# Altium project WireFeeder.PrjPcb
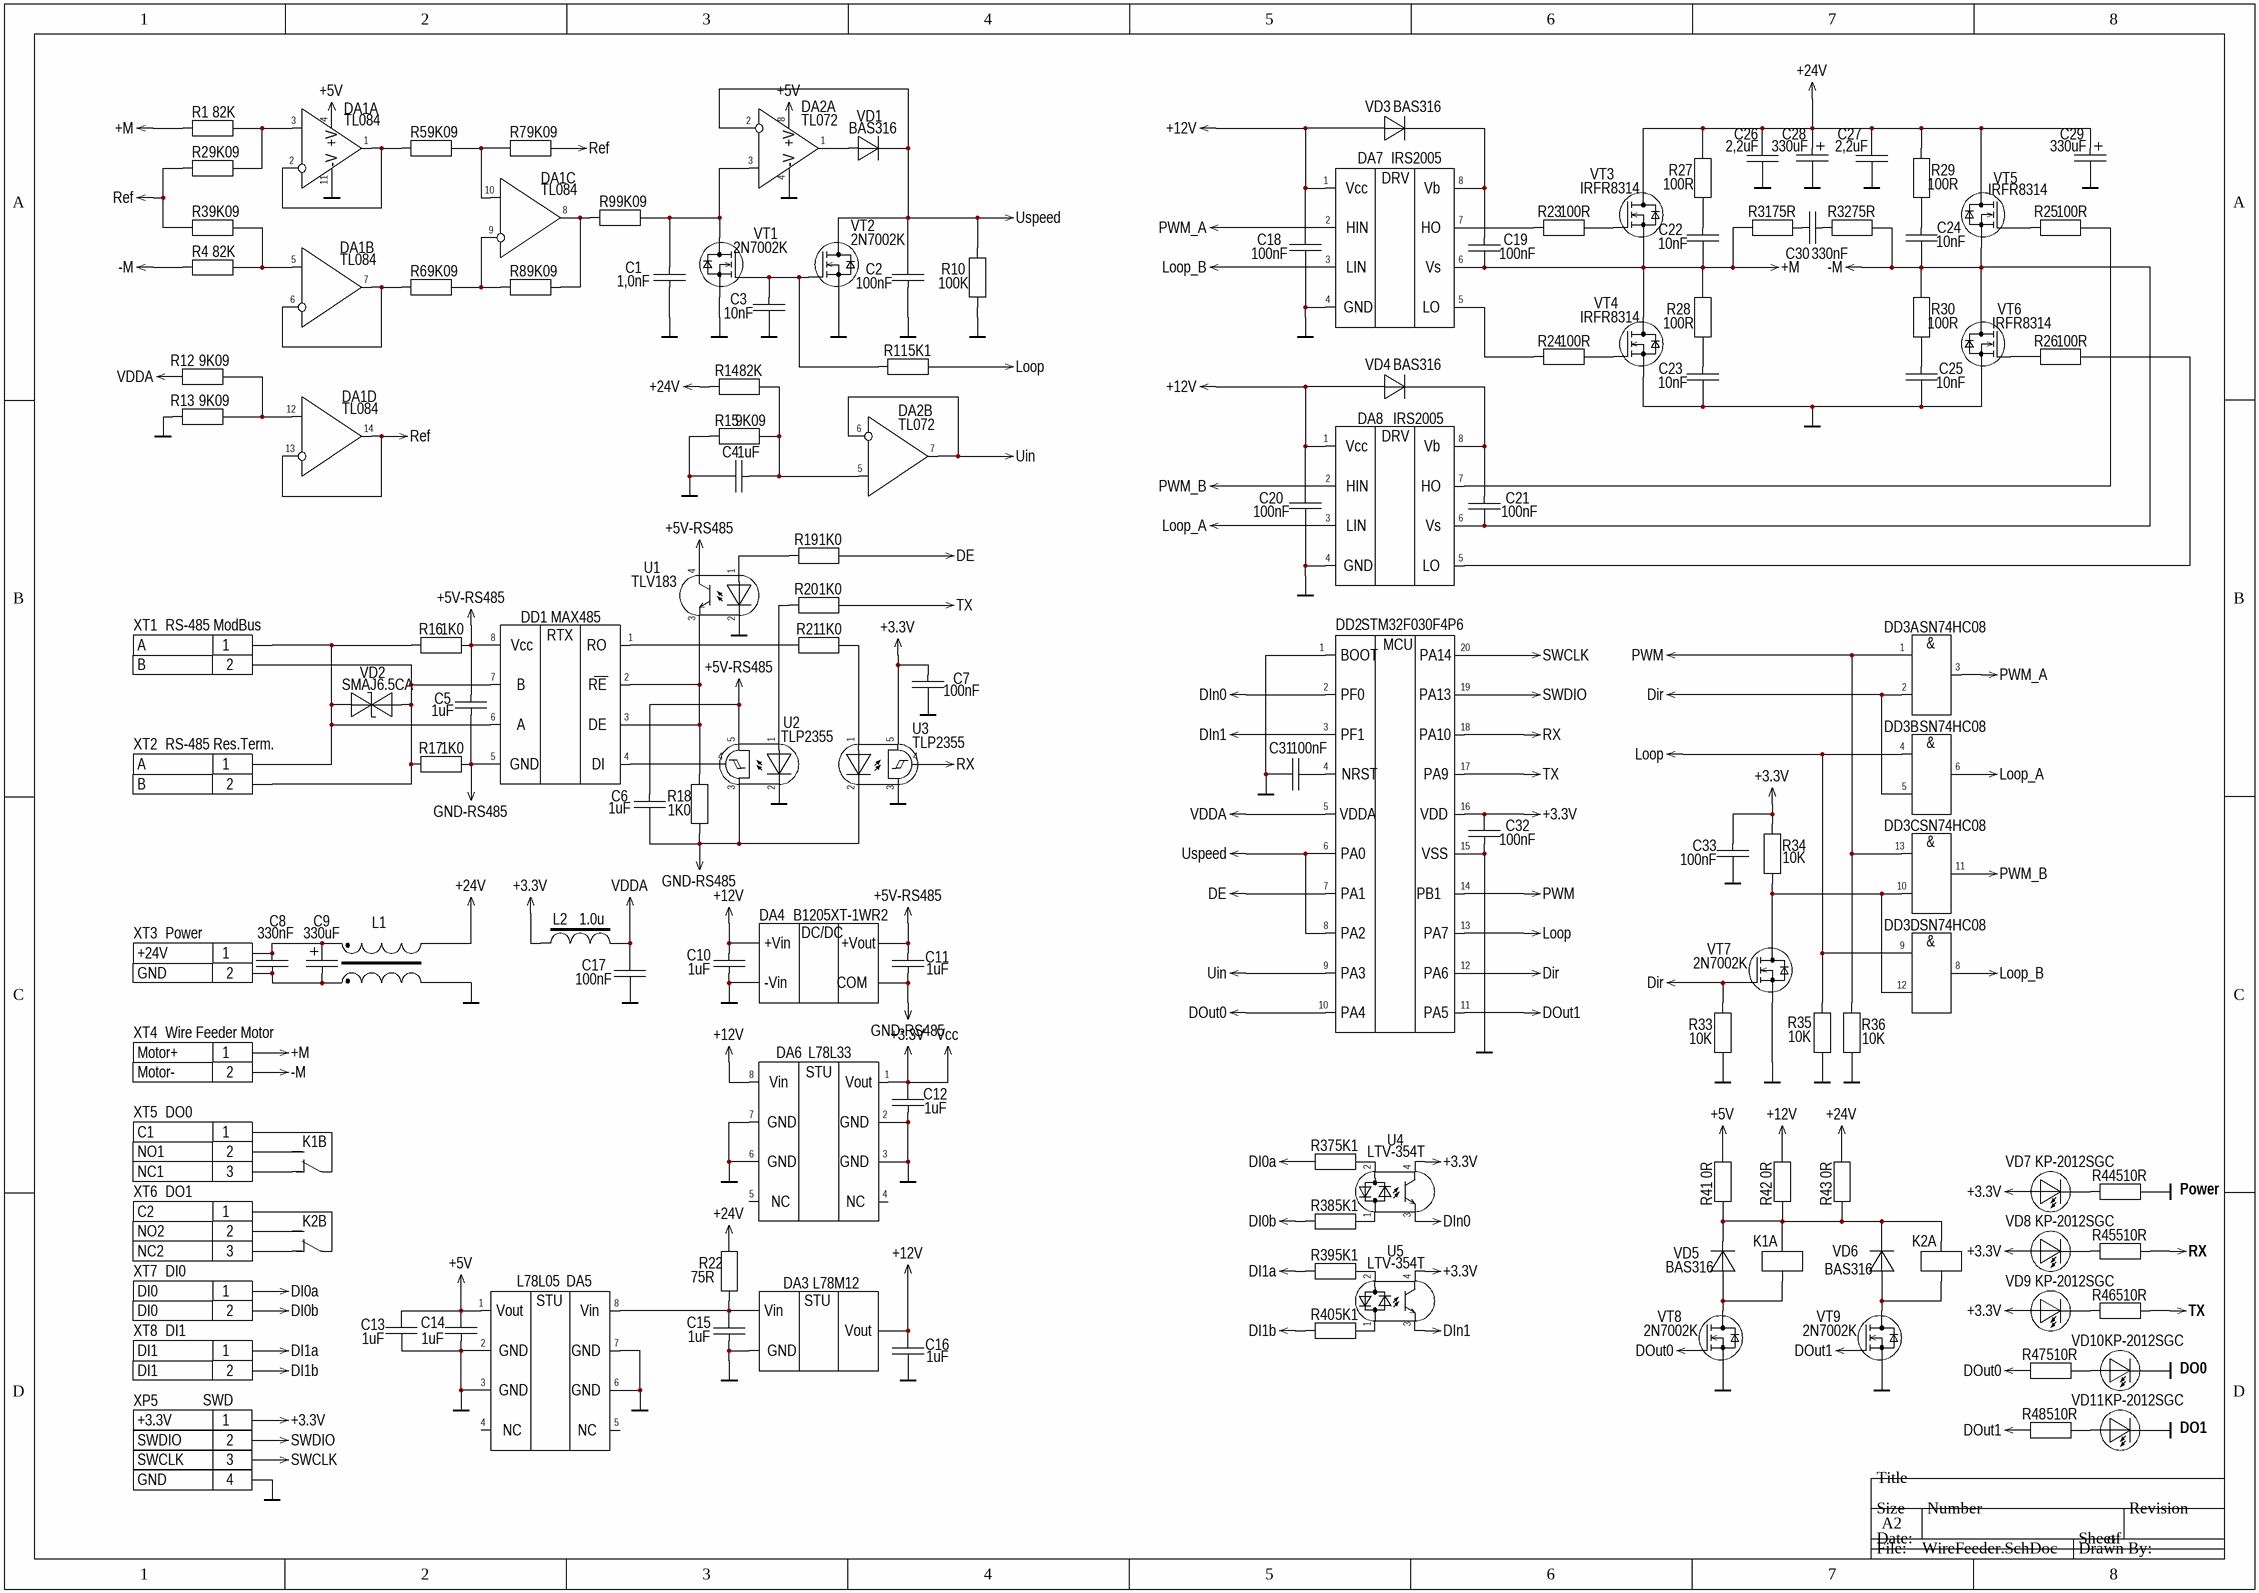
[diagram p0: WireFeeder.SchDoc]
1 sheet, 130 parts. Net scope: global (net labels, ports and power ports of the same name join across sheets).
Board file: WireFeeder.PcbDoc

## Sheet WireFeeder.SchDoc
size A2

### Parts
C1  value 1,0nF  [CAP0805]  (hidden comment: CAP0805 1,0nF±10%, 50 V, X7R)
C2  value 100nF  [CAP0805]  (hidden comment: CAP0805 100nF±10%, 50 V, X7R)
C3  value 10nF  [CAP0805]  (hidden comment: CAP0805 10nF±10%, 50 V, X7R)
C4  value 1uF  [CAP0805]  (hidden comment: CAP0805 1uF±10%, 50 V, X7R)
C5  value 1uF  [CAP0805]  (hidden comment: CAP0805 1uF±10%, 50 V, X7R)
C6  value 1uF  [CAP0805]  (hidden comment: CAP0805 1uF±10%, 50 V, X7R)
C7  value 100nF  [CAP0805]  (hidden comment: CAP0805 100nF±10%, 50 V, X7R)
C8  value 330nF  [CAP1206]  (hidden comment: CAP1206 330nF±10%, 50 V, X7R)
C9  value 330uF  [CapAl10X16X5.0]  (hidden comment: CapAl10X16X5.0mm 330uF, 50 V)
C10  value 1uF  [CAP0805]  (hidden comment: CAP0805 1uF±10%, 50 V, X7R)
C11  value 1uF  [CAP0805]  (hidden comment: CAP0805 1uF±10%, 50 V, X7R)
C12  value 1uF  [CAP0805]  (hidden comment: CAP0805 1uF±10%, 50 V, X7R)
C13  value 1uF  [CAP0805]  (hidden comment: CAP0805 1uF±10%, 50 V, X7R)
C14  value 1uF  [CAP0805]  (hidden comment: CAP0805 1uF±10%, 50 V, X7R)
C15  value 1uF  [CAP0805]  (hidden comment: CAP0805 1uF±10%, 50 V, X7R)
C16  value 1uF  [CAP0805]  (hidden comment: CAP0805 1uF±10%, 50 V, X7R)
C17  value 100nF  [CAP0805]  (hidden comment: CAP0805 100nF±10%, 50 V, X7R)
C18  value 100nF  [CAP0805]  (hidden comment: CAP0805 100nF±10%, 50 V, X7R)
C19  value 100nF  [CAP0805]  (hidden comment: CAP0805 100nF±10%, 50 V, X7R)
C20  value 100nF  [CAP0805]  (hidden comment: CAP0805 100nF±10%, 50 V, X7R)
C21  value 100nF  [CAP0805]  (hidden comment: CAP0805 100nF±10%, 50 V, X7R)
C22  value 10nF  [CAP0805]  (hidden comment: CAP0805 10nF±10%, 50 V, X7R)
C23  value 10nF  [CAP0805]  (hidden comment: CAP0805 10nF±10%, 50 V, X7R)
C24  value 10nF  [CAP0805]  (hidden comment: CAP0805 10nF±10%, 50 V, X7R)
C25  value 10nF  [CAP0805]  (hidden comment: CAP0805 10nF±10%, 50 V, X7R)
C26  value 2,2uF  [CAP1206]  (hidden comment: CAP1206 2,2uF±10%, 50 V, X7R)
C27  value 2,2uF  [CAP1206]  (hidden comment: CAP1206 2,2uF±10%, 50 V, X7R)
C28  value 330uF  [CapAl10X16X5.0]  (hidden comment: CapAl10X16X5.0mm 330uF, 50 V)
C29  value 330uF  [CapAl10X16X5.0]  (hidden comment: CapAl10X16X5.0mm 330uF, 50 V)
C30  value 330nF  [CAP1206]  (hidden comment: CAP1206 330nF±10%, 50 V, X7R)
C31  value 100nF  [CAP0805]  (hidden comment: CAP0805 100nF±10%, 50 V, X7R)
C32  value 100nF  [CAP0805]  (hidden comment: CAP0805 100nF±10%, 50 V, X7R)
C33  value 100nF  [CAP0805]  (hidden comment: CAP0805 100nF±10%, 50 V, X7R)
DA1  TL084 (±18 V)  [SO-14 Narrow]  (value not drawn)  (parts A,B,C,D of 4)
DA2  Model: TL072  [SO-8 Narrow]  (hidden comment: TL072 (±5 V to ±15 V))  (parts A,B of 2)
DA3  Model: L78M12  [D-PAK]  (hidden comment: L78M12 (D-PAK))
DA4  Model: B1205XT-1WR2  [B_XT-1WR2]  (hidden comment: B1205XT-1WR2 (12 V, 5 V))
DA5  Model: L78L05  [SO-8 Narrow]  (hidden comment: L78L05 (SO-8 Narrow))
DA6  Model: L78L33  [SO-8 Narrow]  (hidden comment: L78L33 (SO-8 Narrow))
DA7  IRS2005(SO-8 Narrow)  [SO-8 Narrow]  (value not drawn)
DA8  IRS2005(SO-8 Narrow)  [SO-8 Narrow]  (value not drawn)
DD1  MAX485 (2.5 Mbit, 4.75 V ... 5.25 V )  [SO-8 Narrow]  (value not drawn)
DD2  STM32F030F4P6  [TSSOP-20]
DD3  SN74HC08(SO-14 Narrow)  [SO-14 Narrow]  (value not drawn)  (parts A,B,C,D of 4)
K1  PCB Power Relays 34.51.7.005.00 (Current:6 A, Coil: 5VDC, Form:SPDT (1C); Size: 28X5X15mm)  [34.51]  (value not drawn)  (parts A,B of 2)
K2  PCB Power Relays 34.51.7.005.00 (Current:6 A, Coil: 5VDC, Form:SPDT (1C); Size: 28X5X15mm)  [34.51]  (value not drawn)  (parts A,B of 2)
L1  Common Mode Chokes 19*17*22,5mm: 180uH, 1.2A  [BU10]  (value not drawn)
L2  value 1.0u  [IND0805]  (hidden comment: IND0805 0805 (2.0*1.25mm) 1.0u)
R1  value 82K  [RES2W (800mil)]  (hidden comment: RES2W (16*5.5mm)  82K±5%)
R2  value 9K09  [RES0805]  (hidden comment: RES0805 9K09±1%)
R3  value 9K09  [RES0805]  (hidden comment: RES0805 9K09±1%)
R4  value 82K  [RES2W (800mil)]  (hidden comment: RES2W (16*5.5mm)  82K±5%)
R5  value 9K09  [RES0805]  (hidden comment: RES0805 9K09±1%)
R6  value 9K09  [RES0805]  (hidden comment: RES0805 9K09±1%)
R7  value 9K09  [RES0805]  (hidden comment: RES0805 9K09±1%)
R8  value 9K09  [RES0805]  (hidden comment: RES0805 9K09±1%)
R9  value 9K09  [RES0805]  (hidden comment: RES0805 9K09±1%)
R10  value 100K  [RES0805]  (hidden comment: RES0805 100K±5%)
R11  value 5K1  [RES0805]  (hidden comment: RES0805 5K1±5%)
R12  value 9K09  [RES0805]  (hidden comment: RES0805 9K09±1%)
R13  value 9K09  [RES0805]  (hidden comment: RES0805 9K09±1%)
R14  value 82K  [RES2W (800mil)]  (hidden comment: RES2W (16*5.5mm)  82K±5%)
R15  value 9K09  [RES0805]  (hidden comment: RES0805 9K09±1%)
R16  value 1K0  [RES0805]  (hidden comment: RES0805 1K0±5%)
R17  value 1K0  [RES0805]  (hidden comment: RES0805 1K0±5%)
R18  value 1K0  [RES0805]  (hidden comment: RES0805 1K0±5%)
R19  value 1K0  [RES0805]  (hidden comment: RES0805 1K0±5%)
R20  value 1K0  [RES0805]  (hidden comment: RES0805 1K0±5%)
R21  value 1K0  [RES0805]  (hidden comment: RES0805 1K0±5%)
R22  value 75R  [RES1206]  (hidden comment: RES1206 75R±5%)
R23  value 100R  [RES0805]  (hidden comment: RES0805 100R±5%)
R24  value 100R  [RES0805]  (hidden comment: RES0805 100R±5%)
R25  value 100R  [RES0805]  (hidden comment: RES0805 100R±5%)
R26  value 100R  [RES0805]  (hidden comment: RES0805 100R±5%)
R27  value 100R  [RES0805]  (hidden comment: RES0805 100R±5%)
R28  value 100R  [RES0805]  (hidden comment: RES0805 100R±5%)
R29  value 100R  [RES0805]  (hidden comment: RES0805 100R±5%)
R30  value 100R  [RES0805]  (hidden comment: RES0805 100R±5%)
R31  value 75R  [RES1206]  (hidden comment: RES1206 75R±5%)
R32  value 75R  [RES1206]  (hidden comment: RES1206 75R±5%)
R33  value 10K  [RES0805]  (hidden comment: RES0805 10K±5%)
R34  value 10K  [RES0805]  (hidden comment: RES0805 10K±5%)
R35  value 10K  [RES0805]  (hidden comment: RES0805 10K±5%)
R36  value 10K  [RES0805]  (hidden comment: RES0805 10K±5%)
R37  value 5K1  [RES1206]  (hidden comment: RES1206 5K1±5%)
R38  value 5K1  [RES1206]  (hidden comment: RES1206 5K1±5%)
R39  value 5K1  [RES1206]  (hidden comment: RES1206 5K1±5%)
R40  value 5K1  [RES1206]  (hidden comment: RES1206 5K1±5%)
R41  value 0R  [RES0805]  (hidden comment: RES0805 0R±5%)
R42  value 0R  [RES0805]  (hidden comment: RES0805 0R±5%)
R43  value 0R  [RES0805]  (hidden comment: RES0805 0R±5%)
R44  value 510R  [RES0805]  (hidden comment: RES0805 510R±5%)
R45  value 510R  [RES0805]  (hidden comment: RES0805 510R±5%)
R46  value 510R  [RES0805]  (hidden comment: RES0805 510R±5%)
R47  value 510R  [RES0805]  (hidden comment: RES0805 510R±5%)
R48  value 510R  [RES0805]  (hidden comment: RES0805 510R±5%)
U1  Model: TLV183  [SOP-4]  (hidden comment: LTV183 (80 V, 50 mA))
U2  TLP2355 (5 Mbit, 2.7 V ... 5.5 V )  [SO-6 5pin]  (value not drawn)
U3  TLP2355 (5 Mbit, 2.7 V ... 5.5 V )  [SO-6 5pin]  (value not drawn)
U4  LTV-354T (35 V, 50 mA)  [SOP-4]  (value not drawn)
U5  LTV-354T (35 V, 50 mA)  [SOP-4]  (value not drawn)
VD1  Model: BAS316  [SOD-323]  (hidden comment: BAS316 (100 V, 250 mA, SOD-323))
VD2  Model: SMAJ6.5CA  [SMA Bidirectional]  (hidden comment: SMAJ6.5CA (6.5 V, 400 W, SMA Bidirectional))
VD3  Model: BAS316  [SOD-323]  (hidden comment: BAS316 (100 V, 250 mA, SOD-323))
VD4  Model: BAS316  [SOD-323]  (hidden comment: BAS316 (100 V, 250 mA, SOD-323))
VD5  Model: BAS316  [SOD-323]  (hidden comment: BAS316 (100 V, 250 mA, SOD-323))
VD6  Model: BAS316  [SOD-323]  (hidden comment: BAS316 (100 V, 250 mA, SOD-323))
VD7  Model: KP-2012SGC  [LED0805 GREEN]  (hidden comment: KP-2012SGC (2.2V, 25mA, LED0805 GREEN))
VD8  Model: KP-2012SGC  [LED0805 GREEN]  (hidden comment: KP-2012SGC (2.2V, 25mA, LED0805 GREEN))
VD9  Model: KP-2012SGC  [LED0805 GREEN]  (hidden comment: KP-2012SGC (2.2V, 25mA, LED0805 GREEN))
VD10  Model: KP-2012SGC  [LED0805 GREEN]  (hidden comment: KP-2012SGC (2.2V, 25mA, LED0805 GREEN))
VD11  Model: KP-2012SGC  [LED0805 GREEN]  (hidden comment: KP-2012SGC (2.2V, 25mA, LED0805 GREEN))
VT1  Model: 2N7002K  [SOT23-3 MOSFET (GSD)]  (hidden comment: 2N7002K (60 V, 0.34 A, 1000 mOh, SOT23-3 MOSFET (GSD)))
VT2  Model: 2N7002K  [SOT23-3 MOSFET (GSD)]  (hidden comment: 2N7002K (60 V, 0.34 A, 1000 mOh, SOT23-3 MOSFET (GSD)))
VT3  Model: IRFR8314  [D-PAK MOSFET]  (hidden comment: IRFR8314 (30 V, 179 A, 2.2 mOh, D-PAK MOSFET))
VT4  Model: IRFR8314  [D-PAK MOSFET]  (hidden comment: IRFR8314 (30 V, 179 A, 2.2 mOh, D-PAK MOSFET))
VT5  Model: IRFR8314  [D-PAK MOSFET]  (hidden comment: IRFR8314 (30 V, 179 A, 2.2 mOh, D-PAK MOSFET))
VT6  Model: IRFR8314  [D-PAK MOSFET]  (hidden comment: IRFR8314 (30 V, 179 A, 2.2 mOh, D-PAK MOSFET))
VT7  Model: 2N7002K  [SOT23-3 MOSFET (GSD)]  (hidden comment: 2N7002K (60 V, 0.34 A, 1000 mOh, SOT23-3 MOSFET (GSD)))
VT8  Model: 2N7002K  [SOT23-3 MOSFET (GSD)]  (hidden comment: 2N7002K (60 V, 0.34 A, 1000 mOh, SOT23-3 MOSFET (GSD)))
VT9  Model: 2N7002K  [SOT23-3 MOSFET (GSD)]  (hidden comment: 2N7002K (60 V, 0.34 A, 1000 mOh, SOT23-3 MOSFET (GSD)))
XP5  Pin 4 Name: GND  Pin 3 Name: SWCLK  Pin 2 Name: SWDIO  Pin 1 Name: +3.3V  Name Connector: SWD  [PLS-04]  (hidden comment: XP0003)
XT1  Name Connector: RS-485 ModBus  Pin 2 Name: B  Pin 1 Name: A  [DG306-5.0-2P]  (hidden comment: PCB Screw Terminal Blocks 2-Pin, Pitch 5mm)
XT2  Name Connector: RS-485 Res.Term.  Pin 2 Name: B  Pin 1 Name: A  [DG306-5.0-2P]  (hidden comment: PCB Screw Terminal Blocks 2-Pin, Pitch 5mm)
XT3  Name Connector: Power  Pin 2 Name: GND  Pin 1 Name: +24V  [DG306-5.0-2P]  (hidden comment: PCB Screw Terminal Blocks 2-Pin, Pitch 5mm)
XT4  Name Connector: Wire Feeder Motor  Pin 2 Name: Motor-  Pin 1 Name: Motor+  [DG306-5.0-2P]  (hidden comment: PCB Screw Terminal Blocks 2-Pin, Pitch 5mm)
XT5  Pin 3 Name: NC1  Name Connector: DO0  Pin 2 Name: NO1  Pin 1 Name: C1  [DG306-5.0-3P]  (hidden comment: PCB Screw Terminal Blocks 3-Pin, Pitch 5mm)
XT6  Pin 3 Name: NC2  Name Connector: DO1  Pin 2 Name: NO2  Pin 1 Name: C2  [DG306-5.0-3P]  (hidden comment: PCB Screw Terminal Blocks 3-Pin, Pitch 5mm)
XT7  Name Connector: DI0  [DG306-5.0-2P]  (hidden comment: PCB Screw Terminal Blocks 2-Pin, Pitch 5mm)
XT8  Name Connector: DI1  [DG306-5.0-2P]  (hidden comment: PCB Screw Terminal Blocks 2-Pin, Pitch 5mm)

### Nets
+3.3V: C7.2 C12.2 C32.1 C33.1 DA6.1(Vout) DD2.16(VDD) DD3.14(Vcc) L2.1 R34.2 U3.5(Vcc) U4.4(Collector) U5.4(Collector) VD7.Anode VD8.Anode VD9.Anode XP5.1  [also labelled Vcc]
+5V: C13.2 C14.2 DA1.4(+V) DA2.8(+V) DA5.1(Vout) R41.2
+5V-RS485: C5.2 C6.2 C11.2 DA4.+Vout DD1.8(Vcc) R16.2 U1.4(Collector) U2.5(Vcc)
+12V: C10.2 C16.2 C18.2 C20.2 DA3.Output(Vout) DA4.+Vin DA6.8(Vin) DA7.1(Vcc) DA8.1(Vcc) R42.2 VD3.Anode VD4.Anode
+24V: C26.2 C27.2 C28.1 C29.1 L1.OutA R14.1 R22.2 R27.2 R29.2 R43.2 VT3.Drain VT5.Drain
+M: C19.1 C22.1 DA7.6(Vs) R1.1 R28.2 R31.1 VT3.Source VT4.Drain XT4.1
-M: C21.1 C24.1 DA8.6(Vs) R4.1 R30.2 R32.2 VT5.Source VT6.Drain XT4.2
DE: DD2.7(PA1) R19.2
DI0a: R37.1 XT7.1
DI0b: R38.1 XT7.2
DI1a: R39.1 XT8.1
DI1b: R40.1 XT8.2
DIn0: DD2.2(PF0) U4.3(Emitter)
DIn1: DD2.3(PF1) U5.3(Emitter)
Dir: DD2.12(PA6) DD3.2(1B) DD3.5(2B) R33.2 VT7.Gate
DOut0: DD2.10(PA4) R47.2 VT8.Gate
DOut1: DD2.11(PA5) R48.2 VT9.Gate
GND: C1.1 C2.1 C3.1 C4.2 C7.1 C10.1 C12.1 C13.1 C14.1 C15.1 C16.1 C17.1 C18.1 C20.1 C23.1 C25.1 C26.1 C27.1 C28.2 C29.2 C31.1 C32.2 C33.2 DA1.11(-V) DA2.4(-V) DA3.GND DA4.-Vin DA5.2(GND) DA5.3(GND) DA5.6(GND) DA5.7(GND) DA6.2(GND) DA6.3(GND) DA6.6(GND) DA6.7(GND) DA7.4(GND) DA8.4(GND) DD2.1(BOOT) DD2.15(VSS) DD3.7(GND) L1.OutB R10.1 R13.1 R15.1 R33.1 R35.1 R36.1 R44.1 U1.2(Cathode) U2.2(Cathode) U3.3(GND) VD10.Cathode VD11.Cathode VT1.Source VT2.Source VT4.Source VT6.Source VT7.Source VT8.Source VT9.Source XP5.4
GND-RS485: C5.1 C6.1 C11.1 DA4.COM DD1.5(GND) R17.2 R18.1 U2.3(GND) U3.2(Cathode)
Loop: DD2.13(PA7) DD3.4(2A) DD3.9(3A) R11.2 R35.2
Loop_A: DA8.3(LIN) DD3.6(2Y)
Loop_B: DA7.3(LIN) DD3.8(3Y)
PWM: DD2.14(PB1) DD3.1(1A) DD3.13(4B) R36.2
PWM_A: DA7.2(HIN) DD3.3(1Y)
PWM_B: DA8.2(HIN) DD3.11(4Y)
Ref: DA1.13(-IN2) DA1.14(OUT2) R2.1 R3.1 R7.2
RX: DD2.18(PA10) R45.1 U3.4(Vout)
SWCLK: DD2.20(PA14) XP5.3
SWDIO: DD2.19(PA13) XP5.2
TX: DD2.17(PA9) R20.2 R46.1
Uin: DA2.6(-IN2) DA2.7(OUT2) DD2.9(PA3)
Uspeed: C2.2 DA2.2(-IN1) DD2.6(PA0) DD2.8(PA2) R10.2 VD1.Cathode VT2.Drain
VDDA: C17.2 DD2.5(VDDA) L2.2 R12.1
NetC1_2: C1.2 DA2.3(+IN1) R9.2 VT1.Drain
NetC3_2: C3.2 R11.1 VT1.Gate VT2.Gate
NetC4_1: C4.1 DA2.5(+IN2) R14.2 R15.2
NetC8_1: C8.1 C9.2 L1.InB XT3.2
NetC8_2: C8.2 C9.1 L1.InA XT3.1
NetC15_2: C15.2 DA3.Input(Vin) DA5.8(Vin) R22.1
NetC19_2: C19.2 DA7.8(Vb) VD3.Cathode
NetC21_2: C21.2 DA8.8(Vb) VD4.Cathode
NetC22_2: C22.2 R27.1
NetC23_2: C23.2 R28.1
NetC24_2: C24.2 R29.1
NetC25_2: C25.2 R30.1
NetC30_1: C30.1 R31.2
NetC30_2: C30.2 R32.1
NetC31_2: C31.2 DD2.4(NRST)
NetDA1_1: DA1.1(OUT1) DA1.2(-IN1) R5.1
NetDA1_3: DA1.3(+IN1) R1.2 R2.2
NetDA1_5: DA1.5(+IN2) R3.2 R4.2
NetDA1_6: DA1.6(-IN2) DA1.7(OUT2) R6.1
NetDA1_8: DA1.8(OUT2) R8.2 R9.1
NetDA1_9: DA1.9(-IN2) R6.2 R8.1
NetDA1_10: DA1.10(+IN2) R5.2 R7.1
NetDA1_12: DA1.12(+IN2) R12.2 R13.2
NetDA2_1: DA2.1(OUT1) VD1.Anode
NetDA7_5: DA7.5(LO) R24.1
NetDA7_7: DA7.7(HO) R23.1
NetDA8_5: DA8.5(LO) R26.2
NetDA8_7: DA8.7(HO) R25.2
NetDD1_1: DD1.1(RO) R21.1
NetDD1_2: DD1.2(RE) DD1.3(DE) R18.2 U1.3(Emitter)
NetDD1_4: DD1.4(DI) U2.4(Vout)
NetDD1_6: DD1.6(A) R16.1 VD2.1 XT1.1 XT2.1
NetDD1_7: DD1.7(B) R17.1 VD2.2 XT1.2 XT2.2
NetDD3_10: DD3.10(3B) DD3.12(4A) R34.1 VT7.Drain
NetK1_1A: K1.1A(NO) XT5.2
NetK1_1B: K1.1B(NC) XT5.3
NetK1_1C: K1.1C(NO) XT5.1
NetK1_CoilA: K1.CoilA(Coil) K2.CoilA(Coil) R41.1 R42.1 R43.1 VD5.Cathode VD6.Cathode
NetK1_CoilB: K1.CoilB(Coil) VD5.Anode VT8.Drain
NetK2_1A: K2.1A(NO) XT6.2
NetK2_1B: K2.1B(NC) XT6.3
NetK2_1C: K2.1C(NO) XT6.1
NetK2_CoilB: K2.CoilB(Coil) VD6.Anode VT9.Drain
NetR19_1: R19.1 U1.1(Anode)
NetR20_1: R20.1 U2.1(Anode)
NetR21_2: R21.2 U3.1(Anode)
NetR23_2: R23.2 VT3.Gate
NetR24_2: R24.2 VT4.Gate
NetR25_1: R25.1 VT5.Gate
NetR26_1: R26.1 VT6.Gate
NetR37_2: R37.2 U4.2(InB)
NetR38_2: R38.2 U4.1(InA)
NetR39_2: R39.2 U5.2(InB)
NetR40_2: R40.2 U5.1(InA)
NetR44_2: R44.2 VD7.Cathode
NetR45_2: R45.2 VD8.Cathode
NetR46_2: R46.2 VD9.Cathode
NetR47_1: R47.1 VD10.Anode
NetR48_1: R48.1 VD11.Anode

Not connected (* = marked no-connect by the designer): DA5 4(NC) 5(NC); DA6 4(NC) 5(NC)

### Notes on the sheet
- (near R44) Power
- DO0
- DO1
- (in symbol DA0000) DRV; STU
- (in symbol DA0001) STU
- (in symbol DA0014) STU
- (in symbol DA0069) DC/DC
- (in symbol DD0001, part A) &
- (in symbol DD0001, part B) &
- (in symbol DD0001, part C) &
- (in symbol DD0001, part D) &
- (in symbol STM32F030F4P6) MCU
- (in symbol U0000) RTX

### Library data of the parts
C1 = C0054: GENERAL PURPOSE CLASS 2 CERAMIC CAPACITORS CAP0805 1,0nF±10% 50 V X7R; PartNumber: CC0805KRX7R9BB102; Manufacture: Yageo; Tolerance: ±10%; ID: C0054; Voltage: 50 V; Case: 0805 (2.0*1.25mm); Dielectric: X7R; ComponentLink1Description: GENERAL PURPOSE CLASS 2 CERAMIC CAPACITORS; ComponentLink1URL: C:\Altium Libraries\Passives Library\DataSheet\General Purpose & High Capacitance CERAMIC CAPACITOR CLASS II (Yageo).pdf
C2 C7 C17-C21 C31-C33 = C0066: GENERAL PURPOSE CLASS 2 CERAMIC CAPACITORS CAP0805 100nF±10% 50 V X7R; PartNumber: CC0805KRX7R9BB104; Manufacture: Yageo; Tolerance: ±10%; ID: C0066; Voltage: 50 V; Case: 0805 (2.0*1.25mm); Dielectric: X7R; ComponentLink1Description: GENERAL PURPOSE CLASS 2 CERAMIC CAPACITORS; ComponentLink1URL: #VALUE!
C3 C22-C25 = C0060: GENERAL PURPOSE CLASS 2 CERAMIC CAPACITORS CAP0805 10nF±10% 50 V X7R; PartNumber: CC0805KRX7R9BB103; Manufacture: Yageo; Tolerance: ±10%; ID: C0060; Voltage: 50 V; Case: 0805 (2.0*1.25mm); Dielectric: X7R; ComponentLink1Description: GENERAL PURPOSE CLASS 2 CERAMIC CAPACITORS; ComponentLink1URL: C:\Users\ASGord\OneDrive\Documents\Altium Libraries\Passives Library\DataSheet\General Purpose & High Capacitance CERAMIC CAPACITOR CLASS II (Yageo).pdf
C4-C6 C10-C16 = C0072: GENERAL PURPOSE CLASS 2 CERAMIC CAPACITORS CAP0805 1uF±10% 50 V X7R; PartNumber: CC0805KRX7R9BB105; Manufacture: Yageo; Tolerance: ±10%; ID: C0072; Voltage: 50 V; Case: 0805 (2.0*1.25mm); Dielectric: X7R; ComponentLink1Description: GENERAL PURPOSE CLASS 2 CERAMIC CAPACITORS; ComponentLink1URL: C:\Users\ASGord\OneDrive\Documents\Altium Libraries\Passives Library\DataSheet\General Purpose & High Capacitance CERAMIC CAPACITOR CLASS II (Yageo).pdf
C8 C30 = C0095: GENERAL PURPOSE CLASS 2 CERAMIC CAPACITORS CAP1206 330nF±10% 50 V X7R; PartNumber: CC1206KKX7R9BB334; Manufacture: Yageo; Tolerance: ±10%; ID: C0095; Voltage: 50 V; Case: 1206 (3.1*1.6mm); Dielectric: X7R; ComponentLink1Description: GENERAL PURPOSE CLASS 2 CERAMIC CAPACITORS; ComponentLink1URL: C:\Users\ASGord\OneDrive\Documents\Altium Libraries\Passives Library\DataSheet\General Purpose & High Capacitance CERAMIC CAPACITOR CLASS II (Yageo).pdf
C9 C28 C29 = CAL1102: MINIATURIZED ALUMINUM ELECTROLYTIC CAPACITORS CapAl10X16X5.0 330uF±20% 50 V 105⁰С; PartNumber: EEUHD1H331; Manufacture: Panasonic; Tolerance: ±20%; Voltage: 50 V; Current: 410 mA (100 kHz); ID: CAL1102; Series: HD; Case: 10X16X5.0mm; Temperature: 105⁰С; ComponentLink1Description: MINIATURIZED ALUMINUM ELECTROLYTIC CAPACITORS; ComponentLink1URL: C:\Users\ASGord\OneDrive\Documents\Altium Libraries\Passives Library\DataSheet\Aluminum Electrolytic Capacitors (Panasonic).pdf
C26 C27 = C0099: GENERAL PURPOSE CLASS 2 CERAMIC CAPACITORS CAP1206 2,2uF±10% 50 V X7R; PartNumber: CC1206KKX7R9BB225; Manufacture: Yageo; Tolerance: ±10%; ID: C0099; Voltage: 50 V; Case: 1206 (3.1*1.6mm); Dielectric: X7R; ComponentLink1Description: GENERAL PURPOSE CLASS 2 CERAMIC CAPACITORS; ComponentLink1URL: C:\Users\ASGord\OneDrive\Documents\Altium Libraries\Passives Library\DataSheet\General Purpose & High Capacitance CERAMIC CAPACITOR CLASS II (Yageo).pdf
DA1 = DA0013: TL084 Jfet-Input Operational Amplifier ( TL084, ±18 V, SO-14 Narrow ); Manufacture: TI; PartNumber: TL084CD; ID: DA0013; Supply Voltage: ±18 V; Bandwidth: 3MHz; Model: TL084; ComponentLink1Description: TL084 Jfet-Input Operational Amplifier; ComponentLink1URL: C:\Altium Libraries\Analog IC Library\DataSheet\TL08x(TI).pdf
DA2 = DA0014: TL072 Low-Noise FET-Input Operational Amplifiers ( TL072, ±5 V to ±15 V, SO-8 Narrow ); Manufacture: TI; ID: DA0014; Bandwidth: 5,25MHz; Supply Voltage: ±5 V to ±15 V; PartNumber: TL072; ComponentLink1Description: TL072 Low-Noise FET-Input Operational Amplifiers; ComponentLink1URL: C:\Altium Libraries\Analog IC Library\DataSheet\TL07x(TI).pdf
DA3 = DA0014: Positive voltage regulators L78M12 (12 V, 500 mA, D-PAK, STM); PartNumber: L78M12ABDT-TR; ID: DA0014; Voltage: 12 V; Current: 500 mA; Series: L78M05; Manufacture: STM; ComponentLink1Description: Positive voltage regulators L78M00 Series; ComponentLink1URL: C:\Altium Libraries\Power IC Library\DataSheet\L78M00 series (STM).pdf
DA4 = DA0069: DC-DC Unregulated Single Output Converter B1205XT-1WR2 (12 V, 5 V, 1W, Mornsun); ID: DA0069; IN Voltage: 12 V; OUT Voltage: 5 V; Series: B_XT-1WR2; Power: 1W; PartNumber: B1205XT-1WR2; Manufacture: Mornsun; ComponentLink1Description: 1W DC-DC Unregulated Single Output Converter; ComponentLink1URL: C:\Altium Libraries\Power IC Library\DataSheet\B_XT-1WR2(MORNSUN).pdf
DA5 = DA0001: Positive voltage regulators L78L05 (5 V, 100 mA, SO-8 Narrow, STM); PartNumber: L78L05ABD13TR; ID: DA0001; Voltage: 5 V; Current: 100 mA; Series: L78L00; Manufacture: STM; ComponentLink1Description: Positive voltage regulators L78L00 Series; ComponentLink1URL: C:\Altium Libraries\Power IC Library\DataSheet\L78L00 series (STM).pdf
DA6 = DA0000: Positive voltage regulators L78L33 (3.3 V, 100 mA, SO-8 Narrow, STM); PartNumber: L78L33ABD13TR; ID: DA0000; Voltage: 3.3 V; Current: 100 mA; Series: L78L00; Manufacture: STM; ComponentLink1Description: Positive voltage regulators L78L00 Series; ComponentLink1URL: C:\Altium Libraries\Power IC Library\DataSheet\L78L00 series (STM).pdf
DA7 DA8 = DA0000: IRS2005 High and Low Side Driver  ( SO-8 Narrow, IRF); PartNumber: IRS2005SPBF; ID: DA0000; Model: IRS2005; Manufacture: IRF; ComponentLink1Description: IRS2005 High and Low Side Driver; ComponentLink1URL: C:\Altium Libraries\Power IC Library\DataSheet\IRS2005(IRF).pdf
DD1 = U0000: Low-power transceivers for RS-485 and RS-422 (2.5 Mbit, 4.75 V ... 5.25 V, SO-8 Narrow); PartNumber: MAX483ESA; Manufacture: Maxim; ID: U0000; Qty Channels: 1; Model: MAX485; Speed: 2.5 Mbit; Supply Voltage: 4.75 V ... 5.25 V; ComponentLink1Description: Low-power transceivers for RS-485 and RS-422; ComponentLink1URL: C:\Altium Libraries\Interface IC Library\DataSheet\MAX485(Maxim).pdf
DD2 = STM32F030F4P6: Manufacturer: STMicroelectronics; Flash memory size: 16Kb; RAM memory size: 4Kb; ComponentLink1Description: STM32F030; ComponentLink1URL: https://www.st.com/resource/en/datasheet/stm32f030f4.pdf; Case: TSSOP-20; PartNumber: STM32F030F4P6; Temperature range: - 40 to 85 °C; Name: STM32F030F4P6
DD3 = DD0001: SN74HC08 Quadruple 2-Input Positive-AND Gates; PartNumber: SN74HC08D; Manufacture: TI; ID: DD0001; Model: SN74HC08; Series: HC; ComponentLink1Description: Logic Guide (TI); ComponentLink1URL: C:\Altium Libraries\Digital IC Library\DataSheet\Logic Guide (TI).pdf; ComponentLink2Description: SN74HC08; ComponentLink2URL: C:\Altium Libraries\Digital IC Library\DataSheet\SN74HC08(TI).pdf
K1 K2 = PCB Power Relays 34.51.7.005.00 (Current:6 A, Coil: 5VDC, Form:SPDT (1C); Size: 28X5X15mm): PartNumber: 34.51.7.005.0010; Manufacture: Finder; ID: K0015; Current: 6 A; Series: 34.51; Model: 34.51.7.005.00; Contact form: SPDT (1C); Coil: 5VDC; ComponentLink1Description: Ultra-Slim PCB relays 34 Series (Finder); ComponentLink1URL: C:\Altium Libraries\Electromechanical Library\DataSheet\34 Series (Finder).pdf; ComponentLink2Description: Relays Terminology; ComponentLink2URL: C:\Altium Libraries\Electromechanical Library\DataSheet\Relays Terminology.pdf
L1 = L0126: PartNumber: BU10-1811R2BL; Manufacture: Coilcraft; ID: L0126; Case: BU10; Value: 180uH; Current: 1.2A; ComponentLink1Description: Common Mode Chokes; ComponentLink1URL: C:\Users\ASGord\OneDrive\Documents\Altium Libraries\Passives Library\DataSheet\BUxx series (Coilcraft).pdf
L2 = L0000: SMALL POWER INDUCTOR 1.0u±20% 3.5A; PartNumber: CIGT201208EH1R0MNE; Manufacture: Samsung; Tolerance: ±20%; ID: L0000; Case: 0805 (2.0*1.25mm); Current: 3.5A; ComponentLink1Description: SMALL POWER INDUCTOR; ComponentLink1URL: #VALUE!
R1 R4 R14 = R0118: Carbon Film Fixed Resistors RES2W (16*5.5mm)  82K±5% 500V 2W; PartNumber: KLS6-CF-2W-82KR-J; Manufacture: KLS; Tolerance: ±5%; ID: R0118; Case: RES2W (16*5.5mm); Voltage: 500V; Power: 2W; ComponentLink1Description: Carbon Film Fixed Resistors; ComponentLink1URL: #VALUE!
R2 R3 R5-R9 R12 R13 R15 = R1729: GENERAL PURPOSE CHIP RESISTORS RES0805 9K09±1% 150V 0.125W; PartNumber: RC0805FR-079K09L; Manufacture: Yageo; Tolerance: ±1%; ID: R1729; Case: 0805 (2.0*1.25mm); Voltage: 150V; Power: 0.125W; ComponentLink1Description: GENERAL PURPOSE CHIP RESISTORS; ComponentLink1URL: #VALUE!
R10 = R0477: GENERAL PURPOSE CHIP RESISTORS RES0805 100K±5% 150V 0.125W; PartNumber: RC0805JR-07100KL; Manufacture: Yageo; Tolerance: ±5%; ID: R0477; Case: 0805 (2.0*1.25mm); Voltage: 150V; Power: 0.125W; ComponentLink1Description: GENERAL PURPOSE CHIP RESISTORS; ComponentLink1URL: #VALUE!
R11 = R0446: GENERAL PURPOSE CHIP RESISTORS RES0805 5K1±5% 150V 0.125W; PartNumber: RC0805JR-075K1L; Manufacture: Yageo; Tolerance: ±5%; ID: R0446; Case: 0805 (2.0*1.25mm); Voltage: 150V; Power: 0.125W; ComponentLink1Description: GENERAL PURPOSE CHIP RESISTORS; ComponentLink1URL: C:\Altium Libraries\Passives Library\DataSheet\GENERAL PURPOSE CHIP RESISTORS (Yageo).pdf
R16-R21 = R0429: GENERAL PURPOSE CHIP RESISTORS RES0805 1K0±5% 150V 0.125W; PartNumber: RC0805JR-071K0L; Manufacture: Yageo; Tolerance: ±5%; ID: R0429; Case: 0805 (2.0*1.25mm); Voltage: 150V; Power: 0.125W; ComponentLink1Description: GENERAL PURPOSE CHIP RESISTORS; ComponentLink1URL: C:\Users\ASGord\OneDrive\Documents\Altium Libraries\Passives Library\DataSheet\GENERAL PURPOSE CHIP RESISTORS (Yageo).pdf
R22 R31 R32 = R0580: GENERAL PURPOSE CHIP RESISTORS RES1206 75R±5% 200V 0.25W; PartNumber: RC1206JR-0775RL; Manufacture: Yageo; Tolerance: ±5%; ID: R0580; Case: 1206 (3.1*1.6mm); Voltage: 200V; Power: 0.25W; ComponentLink1Description: GENERAL PURPOSE CHIP RESISTORS; ComponentLink1URL: C:\Users\ASGord\OneDrive\Documents\Altium Libraries\Passives Library\DataSheet\GENERAL PURPOSE CHIP RESISTORS (Yageo).pdf
R23-R30 = R0405: GENERAL PURPOSE CHIP RESISTORS RES0805 100R±5% 150V 0.125W; PartNumber: RC0805JR-07100RL; Manufacture: Yageo; Tolerance: ±5%; ID: R0405; Case: 0805 (2.0*1.25mm); Voltage: 150V; Power: 0.125W; ComponentLink1Description: GENERAL PURPOSE CHIP RESISTORS; ComponentLink1URL: C:\Users\ASGord\OneDrive\Documents\Altium Libraries\Passives Library\DataSheet\GENERAL PURPOSE CHIP RESISTORS (Yageo).pdf
R33-R36 = R0453: GENERAL PURPOSE CHIP RESISTORS RES0805 10K±5% 150V 0.125W; PartNumber: RC0805JR-0710KL; Manufacture: Yageo; Tolerance: ±5%; ID: R0453; Case: 0805 (2.0*1.25mm); Voltage: 150V; Power: 0.125W; ComponentLink1Description: GENERAL PURPOSE CHIP RESISTORS; ComponentLink1URL: C:\Users\ASGord\OneDrive\Documents\Altium Libraries\Passives Library\DataSheet\GENERAL PURPOSE CHIP RESISTORS (Yageo).pdf
R37-R40 = R0624: GENERAL PURPOSE CHIP RESISTORS RES1206 5K1±5% 200V 0.25W; PartNumber: RC1206JR-075K1L; Manufacture: Yageo; Tolerance: ±5%; ID: R0624; Case: 1206 (3.1*1.6mm); Voltage: 200V; Power: 0.25W; ComponentLink1Description: GENERAL PURPOSE CHIP RESISTORS; ComponentLink1URL: C:\Users\ASGord\OneDrive\Documents\Altium Libraries\Passives Library\DataSheet\GENERAL PURPOSE CHIP RESISTORS (Yageo).pdf
R41-R43 = R0356: GENERAL PURPOSE CHIP RESISTORS RES0805 0R±5% 150V 0.125W; PartNumber: RC0805JR-070RL; Manufacture: Yageo; Tolerance: ±5%; ID: R0356; Case: 0805 (2.0*1.25mm); Voltage: 150V; Power: 0.125W; ComponentLink1Description: GENERAL PURPOSE CHIP RESISTORS; ComponentLink1URL: C:\Users\ASGord\OneDrive\Documents\Altium Libraries\Passives Library\DataSheet\GENERAL PURPOSE CHIP RESISTORS (Yageo).pdf
R44-R48 = R0422: GENERAL PURPOSE CHIP RESISTORS RES0805 510R±5% 150V 0.125W; PartNumber: RC0805JR-07510RL; Manufacture: Yageo; Tolerance: ±5%; ID: R0422; Case: 0805 (2.0*1.25mm); Voltage: 150V; Power: 0.125W; ComponentLink1Description: GENERAL PURPOSE CHIP RESISTORS; ComponentLink1URL: C:\Users\ASGord\OneDrive\Documents\Altium Libraries\Passives Library\DataSheet\GENERAL PURPOSE CHIP RESISTORS (Yageo).pdf
U1 = U0002: TLP183 Phototransistor Optocoupler (80 V, 50 mA, SOP-4); PartNumber: TLP183(BL-TPL,E; Manufacture: Toshiba; ID: U0002; Qty Channels: 1; Voltage: 80 V; Current: 50 mA; ComponentLink1Description: TLP183 Phototransistor Optocoupler; ComponentLink1URL: C:\Altium Libraries\Interface IC Library\DataSheet\TLP183(Toshiba).pdf
U2 U3 = U0001: TLP2355 Buffer logic type, 5 MBd Digital Optocoupler (5 Mbit, 2.7 V ... 5.5 V, SO-6 5pin); Manufacture: Toshiba; ID: U0001; Speed: 5 Mbit; Qty Channels: 1; Model: TLP2355; Supply Voltage: 2.7 V ... 5.5 V; PartNumber: TLP2355; ComponentLink1Description: TLP2355 Buffer logic type, 5 MBd Digital Optocoupler; ComponentLink1URL: C:\Altium Libraries\Interface IC Library\DataSheet\TLP2355(Toshiba).pdf
U4 U5 = U0001: LTV-354T Phototransistor Optocoupler (35 V, 50 mA, SOP-4); Manufacture: LiteOn; ID: U0001; Qty Channels: 1; Voltage: 35 V; Current: 50 mA; Model: LTV-354T; PartNumber: LTV-354T; ComponentLink1Description: LTV-354T Phototransistor Optocoupler; ComponentLink1URL: C:\Altium Libraries\Interface IC Library\DataSheet\LTV-354T(LiteOn).pdf
VD1 VD3-VD6 = BAS316 (100 V, 250 mA, SOD-323): DIODE BAS316 (100 V, 250 mA, SOD-323, NXP); PartNumber: BAS316,115; ID: VD0001; Voltage: 100 V; Current: 250 mA; Case: SOD-323; Manufacture: NXP; ComponentLink1Description: BAS316 High-speed switching diode; ComponentLink1URL: C:\Users\Ivan\OneDrive\Altium Libraries\Discrete Semiconductors Library\DataSheet\BAS316,115(NXP).pdf
VD2 = SMAJ6.5CA (6.5 V, 400 W, SMA Bidirectional): TVS DIODE SMAJ6.5CA (6.5 V, 400 W, SMA Bidirectional, STM); PartNumber: SMAJ6.5CA-TR; ID: VD0195; Voltage: 6.5 V; Power: 400 W; Case: SMA; Manufacture: STM; ComponentLink1Description: SMAJ6.5CA Transient Voltage Suppressors; ComponentLink1URL: C:\Users\Ivan\OneDrive\Altium Libraries\Discrete Semiconductors Library\DataSheet\SMAJ Series (STM).pdf
VD7-VD11 = KP-2012SGC (2.2V, 25mA, LED0805 GREEN): LED SMD KP-2012SGC (2.2V, 25mA, LED0805 GREEN); ID: VD003; Color: SUPER BRIGHT GREEN; Luminous Intensity: 15mcd; Voltage: 2.2V; Current: 25mA; Case: 0805; PartNumber: KP-2012SGC; ComponentLink1Description: SMD Green LED 0805; ComponentLink1URL: C:\Altium Libraries\Discrete Semiconductors Library\DataSheet\KP-2012SGC(KGB).pdf
VT1 VT2 VT7-VT9 = VT0020: MOSFET 2N7002K (60 V, 0.34 A, 1000 mOh, SOT23-3 MOSFET (GSD), Hottech); ID: VT0020; Voltage: 60 V; Current: 0.34 A; On-Resistance: 1000 mOh; Case: SOT-23; PartNumber: 2N7002K; Manufacture: Hottech; ComponentLink1Description: 2N7002K  N-Channel MOSFET; ComponentLink1URL: C:\Altium Libraries\Discrete Semiconductors Library\DataSheet\2N7002K(Hottech).pdf
VT3-VT6 = VT0005: MOSFET IRFR8314 (30 V, 179 A, 2.2 mOh, D-PAK MOSFET, IRF); PartNumber: IRFR8314TRPbF; ID: VT0005; Voltage: 30 V; Current: 179 A; On-Resistance: 2.2 mOh; Case: D-PAK; Manufacture: IRF; ComponentLink1Description: IRFR8314 HEXFET Power MOSFET; ComponentLink1URL: C:\Altium Libraries\Discrete Semiconductors Library\DataSheet\IRFR8314PBF(INF).pdf
XP5 = XP0003: Vertical Single Connector PLS-04 3A 250V; PartNumber: DS1021-1x4SF11-3A; Manufacture: CONNFLY; ID: XP0003; Series: PLS; Number of Pins: 4; Current Rating: 3A; Voltage Rating: 250V; ComponentLink1Description: Vertical Single Connector; ComponentLink1URL: C:\Altium Libraries\Connectors Libraries_KI\DataSheet\DS1021.pdf
XT1-XT4 XT7 XT8 = DG306-5.0-2P-12: PCB Screw Terminal Blocks 2-Pole, Pitch 5mm, 250V, 15A per Pin; Manufacture: Degson; ComponentLink1Description: DG306-5.0 Series Connector (Degson); ComponentLink1URL: http://www.degson.com/en/downpdf/id/948.html; PartNumber: DG306-5.0-2P-12
  XT7: Pin 2 Name: DI0; Pin 1 Name: DI0
  XT8: Pin 2 Name: DI1; Pin 1 Name: DI1
XT5 XT6 = DG306-5.0-3P-12: PCB Screw Terminal Blocks 3-Pole, Pitch 5mm, 250V, 15A per Pin; Manufacture: Degson; ComponentLink1Description: DG306-5.0 Series Connector (Degson); ComponentLink1URL: http://www.degson.com/en/downpdf/id/948.html; PartNumber: DG306-5.0-3P-12